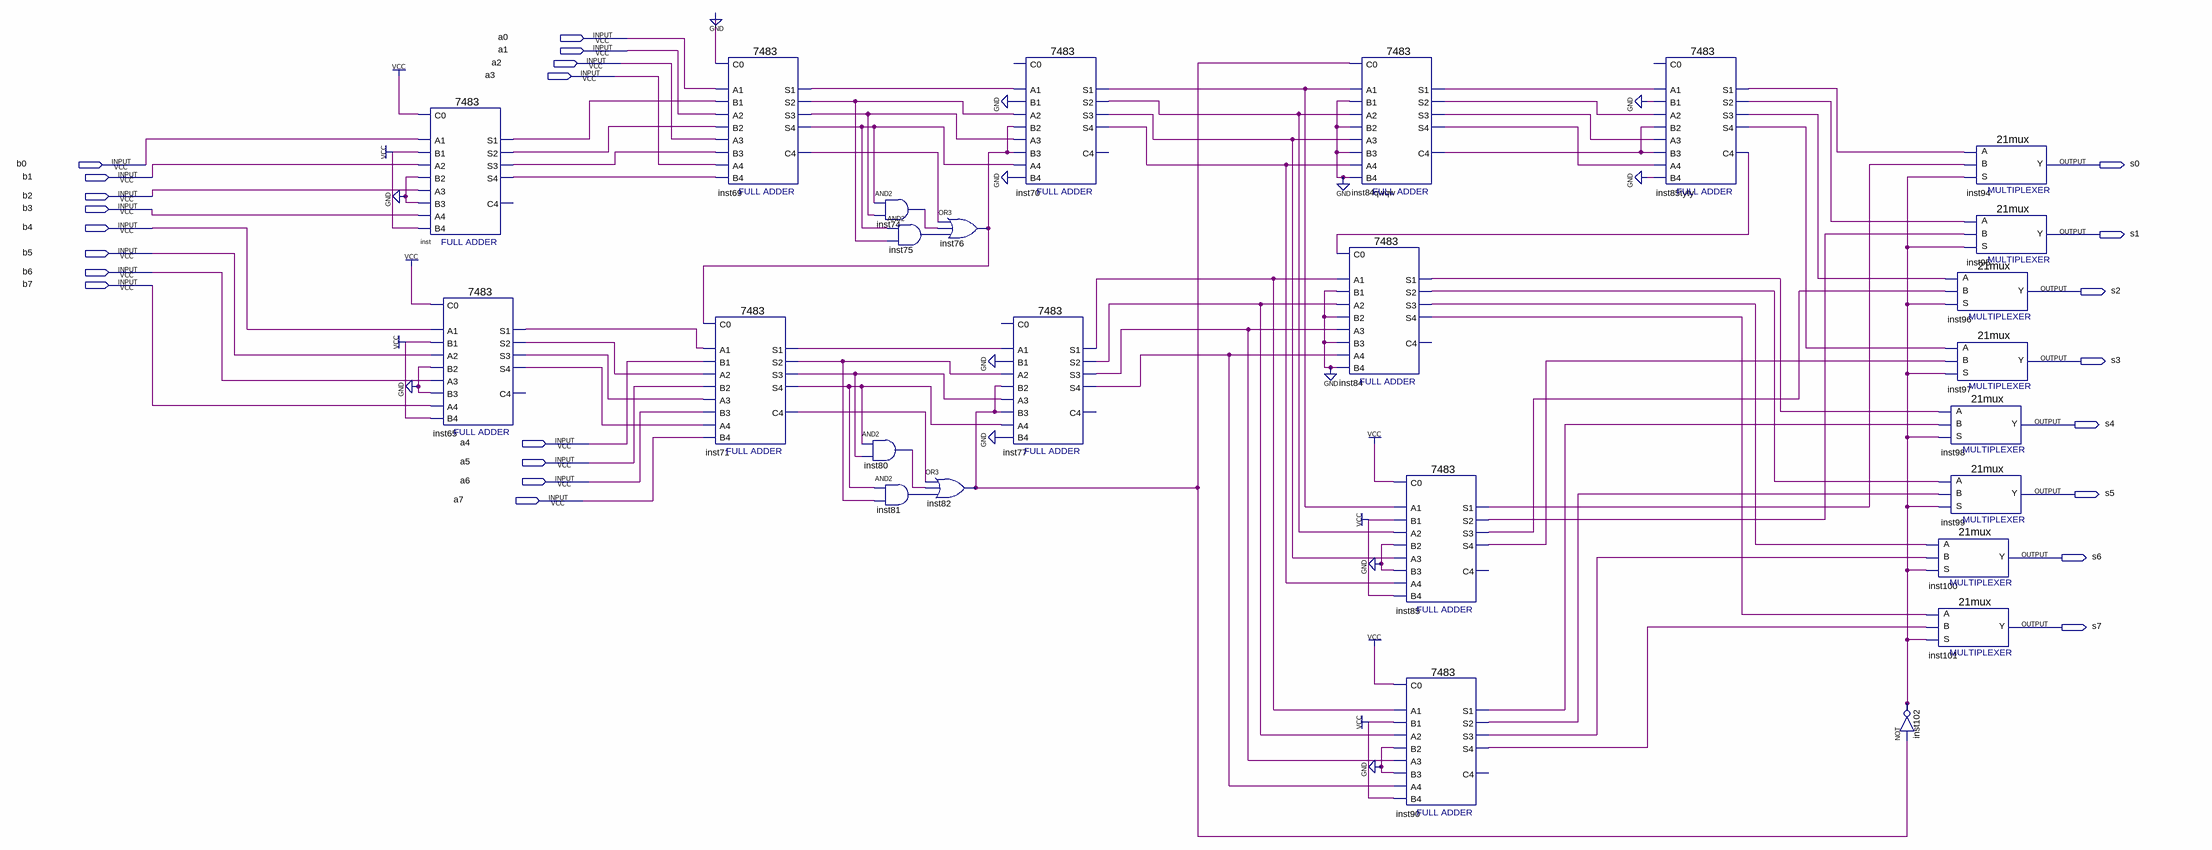
[diagram p0: schematic sheet]
// Quartus schematic Restador.bdf as structural Verilog: 26 symbols, 24 pins
module Restador (
  input  a0,
  input  a1,
  input  a2,
  input  a3,
  input  b0,
  input  b1,
  input  b2,
  input  b3,
  input  b4,
  input  b5,
  input  b6,
  input  b7,
  input  a4,
  input  a5,
  input  a6,
  input  a7,
  output s0,
  output s1,
  output s2,
  output s3,
  output s4,
  output s5,
  output s6,
  output s7
);

  wire inst65_s1, inst65_s2, inst65_s3, inst65_s4, inst69_c4, inst69_s1, inst69_s2, inst69_s3, inst69_s4,
       inst70_s1, inst70_s2, inst70_s3, inst70_s4, inst71_c4, inst71_s1, inst71_s2, inst71_s3, inst71_s4,
       inst74_out, inst75_out, inst76_out, inst77_s1, inst77_s2, inst77_s3, inst77_s4, inst80_out,
       inst81_out, inst82_out, inst84_s1, inst84_s2, inst84_s3, inst84_s4, inst84qwqw_c4, inst84qwqw_s1,
       inst84qwqw_s2, inst84qwqw_s3, inst84qwqw_s4, inst85_s1, inst85_s2, inst85_s3, inst85_s4,
       inst85tyty_c4, inst85tyty_s1, inst85tyty_s2, inst85tyty_s3, inst85tyty_s4, inst90_s1, inst90_s2,
       inst90_s3, inst90_s4, inst102_out, inst_s1, inst_s2, inst_s3, inst_s4;

  \7483  inst (
    .B4(1'b1), .C0(1'b1), .A1(b0), .A2(b1), .B1(1'b1), .B2(1'b0), .A3(b2), .B3(1'b0), .A4(b3), .S3(inst_s3),
    .S4(inst_s4), .S2(inst_s2), .S1(inst_s1));  // open: C4
  \7483  inst65 (
    .B4(1'b1), .C0(1'b1), .A1(b4), .A2(b5), .B1(1'b1), .B2(1'b0), .A3(b6), .B3(1'b0), .A4(b7),
    .S3(inst65_s3), .S4(inst65_s4), .S2(inst65_s2), .S1(inst65_s1));  // open: C4
  \7483  inst71 (
    .B4(a7), .C0(inst76_out), .A1(inst65_s1), .A2(inst65_s2), .B1(a4), .B2(a5), .A3(inst65_s3), .B3(a6),
    .A4(inst65_s4), .S3(inst71_s3), .S4(inst71_s4), .S2(inst71_s2), .C4(inst71_c4), .S1(inst71_s1));
  \7483  inst69 (
    .B4(inst_s4), .C0(1'b0), .A1(a0), .A2(a1), .B1(inst_s1), .B2(inst_s2), .A3(a2), .B3(inst_s3), .A4(a3),
    .S3(inst69_s3), .S4(inst69_s4), .S2(inst69_s2), .C4(inst69_c4), .S1(inst69_s1));
  and inst80 (inst80_out, inst71_s4, inst71_s3);
  and inst74 (inst74_out, inst69_s4, inst69_s3);
  and inst75 (inst75_out, inst69_s4, inst69_s2);
  and inst81 (inst81_out, inst71_s4, inst71_s2);
  or inst76 (inst76_out, inst69_c4, inst74_out, inst75_out);
  or inst82 (inst82_out, inst71_c4, inst80_out, inst81_out);
  \7483  inst70 (
    .B4(1'b0), .A1(inst69_s1), .A2(inst69_s2), .B1(1'b0), .B2(inst76_out), .A3(inst69_s3), .B3(inst76_out),
    .A4(inst69_s4), .S3(inst70_s3), .S4(inst70_s4), .S2(inst70_s2), .S1(inst70_s1));  // open: C0, C4
  \7483  inst77 (
    .B4(1'b0), .A1(inst71_s1), .A2(inst71_s2), .B1(1'b0), .B2(inst82_out), .A3(inst71_s3), .B3(inst82_out),
    .A4(inst71_s4), .S3(inst77_s3), .S4(inst77_s4), .S2(inst77_s2), .S1(inst77_s1));  // open: C0, C4
  \7483  inst84qwqw (
    .B4(1'b0), .C0(inst82_out), .A1(inst70_s1), .A2(inst70_s2), .B1(1'b0), .B2(1'b0), .A3(inst70_s3),
    .B3(1'b0), .A4(inst70_s4), .S3(inst84qwqw_s3), .S4(inst84qwqw_s4), .S2(inst84qwqw_s2),
    .C4(inst84qwqw_c4), .S1(inst84qwqw_s1));
  \7483  inst84 (
    .B4(1'b0), .C0(inst85tyty_c4), .A1(inst77_s1), .A2(inst77_s2), .B1(1'b0), .B2(1'b0), .A3(inst77_s3),
    .B3(1'b0), .A4(inst77_s4), .S3(inst84_s3), .S4(inst84_s4), .S2(inst84_s2), .S1(inst84_s1));  // open: C4
  \7483  inst85 (
    .B4(1'b1), .C0(1'b1), .A1(inst70_s1), .A2(inst70_s2), .B1(1'b1), .B2(1'b0), .A3(inst70_s3), .B3(1'b0),
    .A4(inst70_s4), .S3(inst85_s3), .S4(inst85_s4), .S2(inst85_s2), .S1(inst85_s1));  // open: C4
  \7483  inst90 (
    .B4(1'b1), .C0(1'b1), .A1(inst77_s1), .A2(inst77_s2), .B1(1'b1), .B2(1'b0), .A3(inst77_s3), .B3(1'b0),
    .A4(inst77_s4), .S3(inst90_s3), .S4(inst90_s4), .S2(inst90_s2), .S1(inst90_s1));  // open: C4
  \7483  inst85tyty (
    .B4(1'b0), .A1(inst84qwqw_s1), .A2(inst84qwqw_s2), .B1(1'b0), .B2(inst84qwqw_c4), .A3(inst84qwqw_s3),
    .B3(inst84qwqw_c4), .A4(inst84qwqw_s4), .S3(inst85tyty_s3), .S4(inst85tyty_s4), .S2(inst85tyty_s2),
    .C4(inst85tyty_c4), .S1(inst85tyty_s1));  // open: C0
  \21mux  inst100 (.S(inst102_out), .B(inst90_s3), .A(inst84_s3), .Y(s6));
  \21mux  inst101 (.S(inst102_out), .B(inst90_s4), .A(inst84_s4), .Y(s7));
  not inst102 (inst102_out, inst82_out);
  \21mux  inst94 (.S(inst102_out), .B(inst85_s1), .A(inst85tyty_s1), .Y(s0));
  \21mux  inst95 (.S(inst102_out), .B(inst85_s2), .A(inst85tyty_s2), .Y(s1));
  \21mux  inst96 (.S(inst102_out), .B(inst85_s3), .A(inst85tyty_s3), .Y(s2));
  \21mux  inst97 (.S(inst102_out), .B(inst85_s4), .A(inst85tyty_s4), .Y(s3));
  \21mux  inst98 (.S(inst102_out), .B(inst90_s1), .A(inst84_s1), .Y(s4));
  \21mux  inst99 (.S(inst102_out), .B(inst90_s2), .A(inst84_s2), .Y(s5));
endmodule
